# Altium schematic sheet subckt_SMPS_EMI_filter.SchDoc: SMPS EMI filter
size A3; DocumentNumber: 10; Revision: 0; SheetNumber: 10; SheetTotal: 19
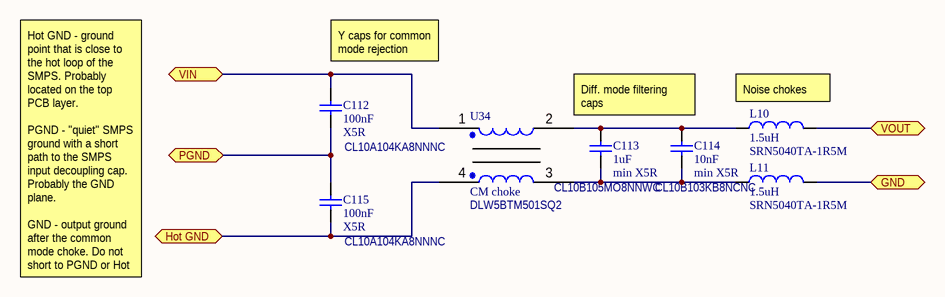
[diagram p0: subckt_SMPS_EMI_filter.SchDoc]

## Parts
C112  value 100nF  Dielectric: X5R  Model: CL10A104KA8NNNC  [CAP0603]  (hidden comment: Capacitor)
C113  value 1uF  Dielectric: min X5R  Model: CL10B105MO8NNWC  [CAP0603]  (hidden comment: Capacitor)
C114  value 10nF  Dielectric: min X5R  Model: CL10B103KB8NCNC  [CAP0603]  (hidden comment: Capacitor)
C115  value 100nF  Dielectric: X5R  Model: CL10A104KA8NNNC  [CAP0603]  (hidden comment: Capacitor)
L10  value 1.5uH  Model: SRN5040TA-1R5M  [MHCC06030]  (hidden comment: Inductor)
L11  value 1.5uH  Model: SRN5040TA-1R5M  [MHCC06030]  (hidden comment: Inductor)
U34  CM choke  Model: DLW5BTM501SQ2  [Murata_DLW5A/5B]

## Ports
GND, Hot GND, PGND, VIN, VOUT

## Nets
GND: L11.2 ; port GND
Hot GND: C115.1 U34.4 ; port Hot GND
PGND: C112.1 C115.2 ; port PGND
VIN: C112.2 U34.1 ; port VIN
VOUT: L10.2 ; port VOUT
NetC113_1: C113.1 C114.1 L11.1 U34.3
NetC113_2: C113.2 C114.2 L10.1 U34.2

## Notes on the sheet
- (near C112) Y caps for common mode rejection
- Diff. mode filtering caps
- (near L10) Noise chokes
- Hot GND - ground point that is close to the hot loop of the SMPS. Probably located on the top PCB layer.
  PGND - "quiet" SMPS ground with a short path to the SMPS input decoupling cap. Probably the GND plane.
  GND - output ground after the common mode choke. Do not short to PGND or Hot GND!

## Library data of the parts
U34 = Common_choke: Common mode choke